# EAGLE design apprino (EAGLE 6.2)
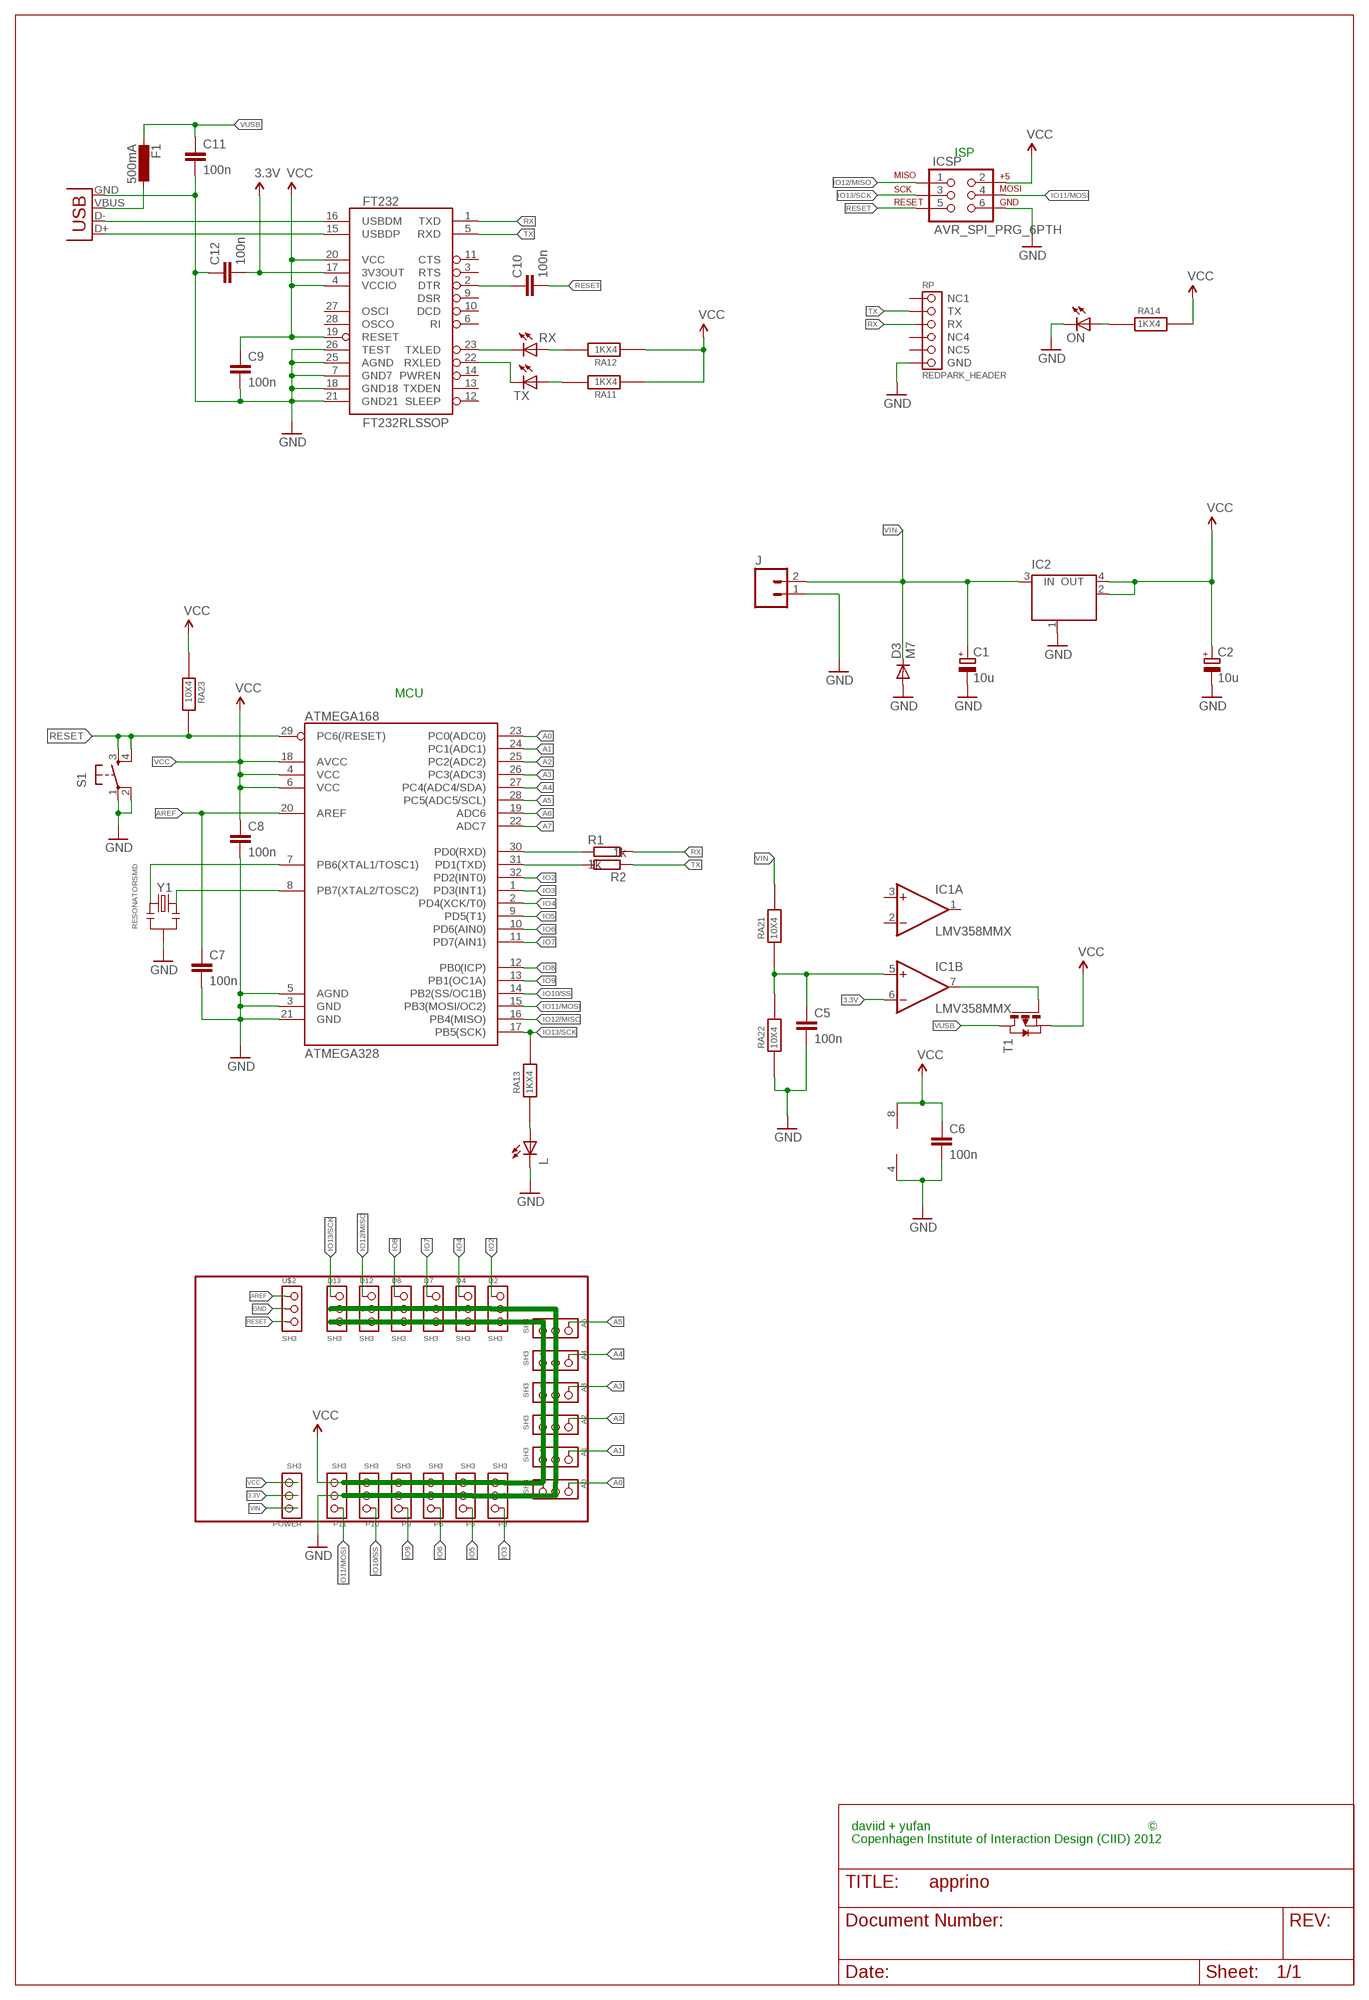
[diagram p0: schematic, sheet 1]

## Parts
A0  SH3  [SH3]
A1  SH3  [SH3]
A2  SH3  [SH3]
A3  SH3  [SH3]
A4  SH3  [SH3]
A5  SH3  [SH3]
ATMEGA328  ATMEGA168  [TQFP32-08]
C1  10u  CPOL-EUSMCB  [SMC_B]
C2  10u  CPOL-EUSMCB  [SMC_B]
C5  100n  C-EUC0805  [C0805]
C6  100n  C-EUC0805  [C0805]
C7  100n  C-EUC0805  [C0805]
C8  100n  C-EUC0805  [C0805]
C9  100n  C-EUC0805  [C0805]
C10  100n  C-EUC0805  [C0805]
C11  100n  C-EUC0805  [C0805]
C12  100n  C-EUC0805  [C0805]
D2  SH3  [SH3]
D3  M7  DIODE-SMB  [SMB]
D4  SH3  [SH3]
D7  SH3  [SH3]
D8  SH3  [SH3]
D12  SH3  [SH3]
D13  SH3  [SH3]
F1  500mA  L-EUL1812  [L1812]
FT232  FT232RLSSOP  [SSOP28DB]
IC1  LMV358MMX  [MSOP08]
IC2  MC33269ST-3.3T3  [SOT223]
ICSP  AVR_SPI_PRG_6PTH  [2X3]
J  M02-JST-2MM-SMT  [JST-2-SMD]
L  LEDCHIP-LED0805  [CHIP-LED0805]
ON  LEDCHIP-LED0805  [CHIP-LED0805]
P3  SH3  [SH3]
P5  SH3  [SH3]
P6  SH3  [SH3]
P9  SH3  [SH3]
P10  SH3  [SH3]
P11  SH3  [SH3]
POWER  SH3  [SH3]
R1  1k  R-EU_M0805  [M0805]
R2  1k  R-EU_M0805  [M0805]
RA1  1KX4  [R4ARRAY]
RA2  10X4  [R4ARRAY]
RP  REDPARK_HEADER  [REDPARK_HEADER]
RX  LEDCHIP-LED0805  [CHIP-LED0805]
S1  TAC_SWITCHSMD  [TACTILE_SWITCH_SMD]
T1  PMOSSOT23  [SOT-23]
TX  LEDCHIP-LED0805  [CHIP-LED0805]
U$2  SH3  [SH3]
USB  USB-MICROB  [USB-MICROB]
Y1  RESONATORSMD  [RESONATOR-SMD]

## Nets
3.3V: C12.2 FT232.17(3V3OUT) IC1.6(B:-IN) POWER.-
A0: A0.S ATMEGA328.23(PC0(ADC0))
A1: A1.S ATMEGA328.24(PC1(ADC1))
A2: A2.S ATMEGA328.25(PC2(ADC2))
A3: A3.S ATMEGA328.26(PC3(ADC3))
A4: A4.S ATMEGA328.27(PC4(ADC4/SDA))
A5: A5.S ATMEGA328.28(PC5(ADC5/SCL))
A6: ATMEGA328.19(ADC6)
A7: ATMEGA328.22(ADC7)
AREF: ATMEGA328.20(AREF) C7.1 U$2.S
GND: A0.- A1.- A2.- A3.- A4.- A5.- ATMEGA328.3(GND) ATMEGA328.5(AGND) ATMEGA328.21(GND) C1.- C2.- C5.2 C6.2 C7.2 C8.2 C9.2 C11.2 C12.1 D2.- D3.A D4.- D7.- D8.- D12.- D13.- FT232.7(GND7) FT232.18(GND18) FT232.21(GND21) FT232.25(AGND) FT232.26(TEST) IC1.4(P:V-) IC2.1(GND/ADJ) ICSP.6 J.1 L.C ON.C P3.- P5.- P6.- P9.- P10.- P11.- RA2.2 RP.6(GND) S1.1 S1.2 U$2.- USB.GND Y1.2
IO2: ATMEGA328.32(PD2(INT0)) D2.S
IO3: ATMEGA328.1(PD3(INT1)) P3.S
IO4: ATMEGA328.2(PD4(XCK/T0)) D4.S
IO5: ATMEGA328.9(PD5(T1)) P5.S
IO6: ATMEGA328.10(PD6(AIN0)) P6.S
IO7: ATMEGA328.11(PD7(AIN1)) D7.S
IO8: ATMEGA328.12(PB0(ICP)) D8.S
IO9: ATMEGA328.13(PB1(OC1A)) P9.S
IO10/SS: ATMEGA328.14(PB2(SS/OC1B)) P10.S
IO11/MOSI: ATMEGA328.15(PB3(MOSI/OC2)) ICSP.4 P11.S
IO12/MISO: ATMEGA328.16(PB4(MISO)) D12.S ICSP.1
IO13/SCK: ATMEGA328.17(PB5(SCK)) D13.S ICSP.3 RA1.6
N$1: ATMEGA328.7(PB6(XTAL1/TOSC1)) Y1.1
N$2: ATMEGA328.8(PB7(XTAL2/TOSC2)) Y1.3
N$3: FT232.16(USBDM) USB.D-
N$4: FT232.15(USBDP) USB.D+
N$5: RA1.7 RX.A
N$6: FT232.23(TXLED) RX.C
N$7: F1.1 USB.VBUS
N$8: RA1.8 TX.A
N$9: ON.A RA1.4
N$10: L.A RA1.3
N$11: ATMEGA328.30(PD0(RXD)) R1.1
N$12: ATMEGA328.31(PD1(TXD)) R2.2
N$13: C10.1 FT232.2(DTR)
N$16: FT232.22(RXLED) TX.C
N$17: C5.1 IC1.5(B:+IN) RA2.1 RA2.7
N$18: IC1.7(B:OUT) T1.3(G)
RESET: ATMEGA328.29(PC6(/RESET)) C10.2 ICSP.5 RA2.6 S1.3 S1.4 U$2.+
RX: FT232.1(TXD) R1.2 RP.3(RX)
TX: FT232.5(RXD) R2.1 RP.2(TX)
VCC: A0.+ A1.+ A2.+ A3.+ A4.+ A5.+ ATMEGA328.4(VCC) ATMEGA328.6(VCC) ATMEGA328.18(AVCC) C2.+ C6.1 C8.1 C9.1 D2.+ D4.+ D7.+ D8.+ D12.+ D13.+ FT232.4(VCCIO) FT232.19(RESET) FT232.20(VCC) IC1.8(P:V+) IC2.2(OUT) IC2.4(OUT) ICSP.2 P3.+ P5.+ P6.+ P9.+ P10.+ P11.+ POWER.+ RA1.1 RA1.2 RA1.5 RA2.3 T1.2(S)
VIN: C1.+ D3.C IC2.3(IN) J.2 POWER.S RA2.8
VUSB: C11.1 F1.2 T1.1(D)
Unconnected: FT232.3(RTS) FT232.6(RI) FT232.9(DSR) FT232.10(DCD) FT232.11(CTS) FT232.12(SLEEP) FT232.13(TXDEN) FT232.14(PWREN) FT232.27(OSCI) FT232.28(OSCO) IC1.1(A:OUT) IC1.2(A:-IN) IC1.3(A:+IN) RA2.4 RA2.5 RP.1(NC1) RP.4(NC4) RP.5(NC5)

## Notes on the sheet
- ISP
- MCU
- daviid + yufan | ©
- Copenhagen Institute of Interaction Design (CIID) 2012

## Library data of the parts
A0 A1-A5 D2 D4 D7 D8 D12 D13 P3 P5 P6 P9-P11 POWER U$2 = appessory:SH3
ATMEGA328 = SparkFun:ATMEGA168
C1 C2 = rcl:CPOL-EU: POLARIZED CAPACITOR, European symbol
C5-C12 = rcl:C-EU: CAPACITOR, European symbol
D3 = diode:DIODE-: DIODE
F1 = rcl:L-EU: INDUCTOR, European symbol
FT232 = SparkFun:FT232RL: USB UART FT232RL 4th Generation USB UART (USB <-> Serial) Controller. Spark Fun Electronics SKU : COM-00650
IC1 = linear:LMV358?*: Dual General Purpose, Low Voltage, Rail-to-Rail Output Operational Amplifiers Source: http://www.national.com/mpf/LM/LMV321.html http://www.national.com/dt/lmv_qual.pdf
IC2 = linear:MC33269ST*: Adjustable Output Low Dropout Voltage Regulator 800 mA Source: http://www.onsemi.com/pub/Collateral/MC33269-D.PDF
ICSP = SparkFun:AVR_SPI_PRG_6: AVR ISP 6 Pin This is the reduced ISP connector for AVR programming. Common on Arduino. This footprint will take up less PCB space and can be used with a 10-pin to 6-pin adapter such as SKU: BOB-08508
J = SparkFun:M02: Header 2 Standard 2-pin 0.1" header. Use with straight break away headers (SKU : PRT-00116), right angle break away headers (PRT-00553), swiss pins (PRT-00743), machine pins (PRT-00117), and female headers (PRT-00115). Molex polarized connector foot print use with SKU : PRT-08233 with associated crimp pins and housings.
L ON RX TX = led:LED: LED OSRAM: - CHIPLED LG R971, LG N971, LY N971, LG Q971, LY Q971, LO R971, LY R971 LH N974, LH R974 LS Q976, LO Q976, LY Q976 LO Q996 - Hyper CHIPLED LW Q18S LB Q993, LB Q99A, LB R99A - SideLED LS A670, LO A670, LY A670, LG A670, LP A670 LB A673, LV A673, LT A673, LW A673 LH A674 LY A675 LS A676, LA A676, LO A676, LY A676, LW A676 LS A679, LY A679, LG A679 - Hyper Micro SIDELED® LS Y876, LA Y876, LO Y876, LY Y876 LT Y87S - SmartLED LW L88C, LW L88S LB L89C, LB L89S, LG L890 LS L89K, LO L89K, LY L89K LS L896, LA L896, LO L896, LY L896 - TOPLED LS T670, LO T670, LY T670, LG T670, LP T670 LSG T670, LSP T670, LSY T670, LOP T670, LYG T670 LG T671, LOG T671, LSG T671 LB T673, LV T673, LT T673, LW T673 LH T674 LS T676, LA T676, LO T676, LY T676, LB T676, LH T676, LSB T676, LW T676 LB T67C, LV T67C, LT T67C, LS T67K, LO T67K, LY T67K, LW E67C LS E67B, LA E67B, LO E67B, LY E67B, LB E67C, LV E67C, LT E67C LW T67C LS T679, LY T679, LG T679 LS T770, LO T770, LY T770, LG T770, LP T770 LB T773, LV T773, LT T773, LW T773 LH T774 LS E675, LA E675, LY E675, LS T675 LS T776, LA T776, LO T776, LY T776, LB T776 LHGB T686 LT T68C, LB T68C - Hyper Mini TOPLED® LB M676 - Mini TOPLED Santana® LG M470 LS M47K, LO M47K, LY M47K Source: http://www.osram.convergy.de LUXEON: - LUMILED® LXK2-PW12-R00, LXK2-PW12-S00, LXK2-PW14-U00, LXK2-PW14-V00 LXK2-PM12-R00, LXK2-PM12-S00, LXK2-PM14-U00 LXK2-PE12-Q00, LXK2-PE12-R00, LXK2-PE12-S00, LXK2-PE14-T00, LXK2-PE14-U00 LXK2-PB12-K00, LXK2-PB12-L00, LXK2-PB12-M00, LXK2-PB14-N00, LXK2-PB14-P00, LXK2-PB14-Q00 LXK2-PR12-L00, LXK2-PR12-M00, LXK2-PR14-Q00, LXK2-PR14-R00 LXK2-PD12-Q00, LXK2-PD12-R00, LXK2-PD12-S00 LXK2-PH12-R00, LXK2-PH12-S00 LXK2-PL12-P00, LXK2-PL12-Q00, LXK2-PL12-R00 Source: www.luxeon.com KINGBRIGHT: KA-3528ASYC Source: www.kingbright.com
R1 R2 = rcl:R-EU_: RESISTOR, European symbol
RA1 = appessory:1KX4
RA2 = appessory:10X4
RP = appessory:REDPARK_HEADER
S1 = SparkFun:TAC_SWITCH: Momentary Switch Button commonly used for reset or general input. Spark Fun Electronics SKU : COM-00097
T1 = zetex:PMOSSOT23: MOS FET; OC_FARNELL: unknown; OC_NEWARK: unknown
USB = SparkFun:USB: USB Connectors USB-B-PTH is fully proven SKU : PRT-00139 USB-miniB is fully proven SKU : PRT-00587 USB-A-PCB is untested. USB-A-H is throughly reviewed, but untested. Spark Fun Electronics SKU : PRT-00437 USB-B-SMT is throughly reviewed, but untested. Needs silkscreen touching up. USB-A-S has not been used/tested USB-MB-H has not been used/tested
Y1 = SparkFun:RESONATOR: Resonator Small SMD resonator. This is the itty bitty 10/20MHz resonators with built in caps. CSTCE10M0G55 and CSTCE20M0V53. Footprint has been reviewed closely but hasn't been tested yet.

## Board
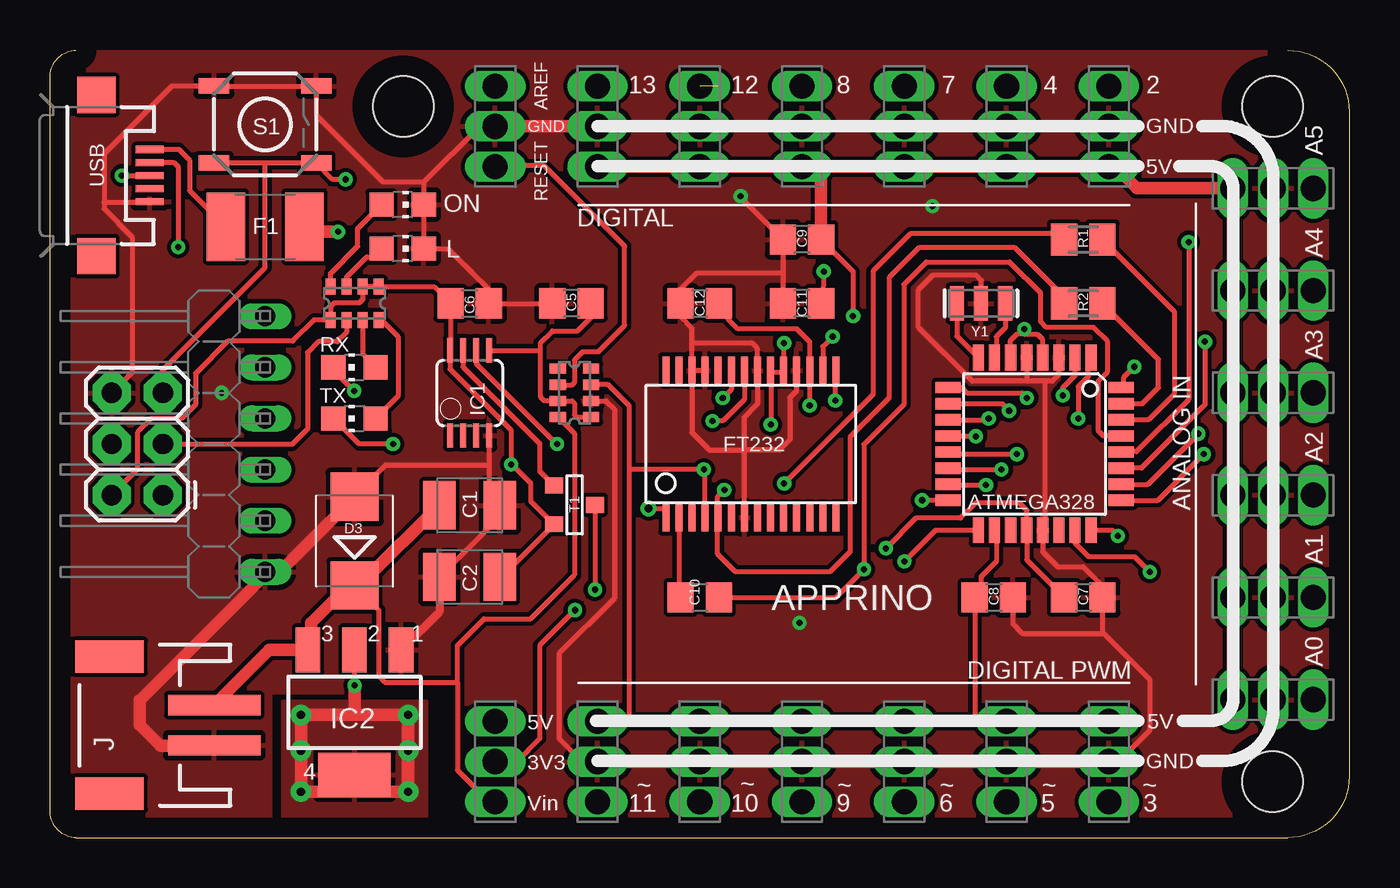
[diagram p1: board, top side]
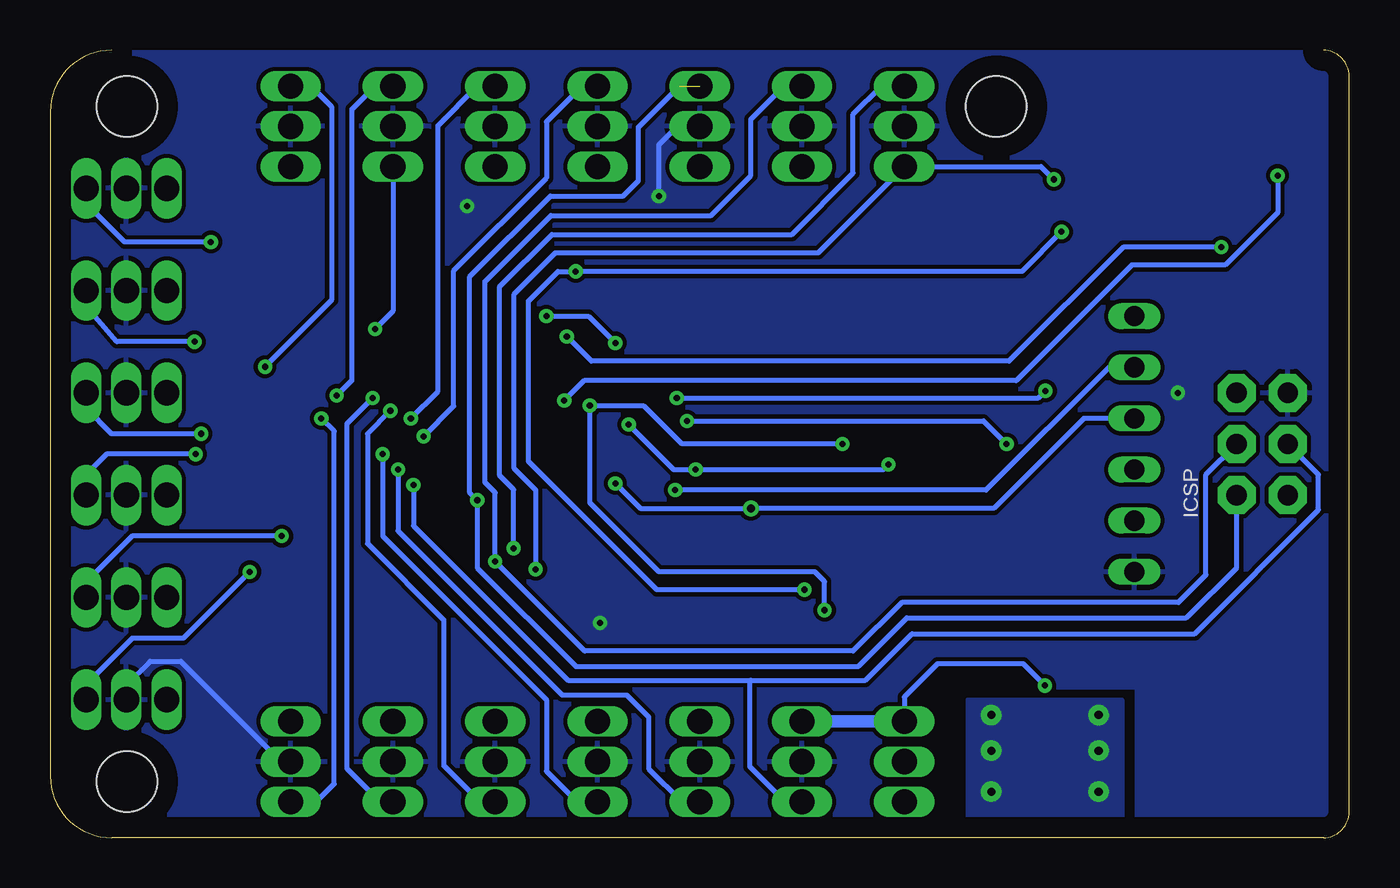
[diagram p2: board, bottom side, seen from below]

Size 64.52 x 39.12 mm. Coordinates in mm from the lower left corner, seen from the top.
Outline: 61.47,39.12 arc-90 64.52,36.07 64.52,3.05 arc-90 61.47,0 1.27,0 arc-90 0,1.27 0,37.85 arc-90 1.27,39.12
Copper layers (1*16): Top 0.035mm / dielectric 1.5mm / Bottom 0.035mm
Design rules: minimum track width 10mil, minimum drill 19mil, track to track 8mil, track to pad 8mil, pad to pad 8mil, via to via 8mil, smd to smd 8mil, copper to edge 40mil, drill to drill 8mil, minimum pad ring 5mil, minimum via ring 8mil, stop-mask expansion 4mil, vias tented up to drill 0mil, thermal gap 10mil
Holes 3 mm at 60.71,2.79 60.71,36.32 17.53,36.32

### Footprints (pad centres in the part's own frame; a part is rotated, then mirrored left to right if it is on the bottom)
SH3 = drill 1.25 pad 1.5 long: + 0,-4; - 0,-2; S 0,0
TQFP32-08 = smd 1.27 x 0.559: 1 -4.293,2.8; 2 -4.293,2; 3 -4.293,1.2; 4 -4.293,0.4; 5 -4.293,-0.4; 6 -4.293,-1.2; 7 -4.293,-2; 8 -4.293,-2.8; 17 4.293,-2.8; 18 4.293,-2; 19 4.293,-1.2; 20 4.293,-0.4; 21 4.293,0.4; 22 4.293,1.2; 23 4.293,2; 24 4.293,2.8 | smd 0.559 x 1.27: 9 -2.8,-4.293; 10 -2,-4.293; 11 -1.2,-4.293; 12 -0.4,-4.293; 13 0.4,-4.293; 14 1.2,-4.293; 15 2,-4.293; 16 2.8,-4.293; 25 2.8,4.293; 26 2,4.293; 27 1.2,4.293; 28 0.4,4.293; 29 -0.4,4.293; 30 -1.2,4.293; 31 -2,4.293; 32 -2.8,4.293
SMC_B = smd 1.6 x 2.4: + -1.5,0; - 1.5,0
C0805 = smd 1.3 x 1.5: 1 -0.95,0; 2 0.95,0
SMB = smd 2.4 x 2.4: A 2.2,0; C -2.2,0
L1812 = smd 1.9 x 3.4: 1 -1.95,0; 2 1.95,0
SSOP28DB = smd 0.348 x 1.397: 1 -4.225,-3.656; 2 -3.575,-3.656; 3 -2.925,-3.656; 4 -2.275,-3.656; 5 -1.625,-3.656; 6 -0.975,-3.656; 7 -0.325,-3.656; 8 0.325,-3.656; 9 0.975,-3.656; 10 1.625,-3.656; 11 2.275,-3.656; 12 2.925,-3.656; 13 3.575,-3.656; 14 4.225,-3.656; 15 4.225,3.656; 16 3.575,3.656; 17 2.925,3.656; 18 2.275,3.656; 19 1.625,3.656; 20 0.975,3.656; 21 0.325,3.656; 22 -0.325,3.656; 23 -0.975,3.656; 24 -1.625,3.656; 25 -2.275,3.656; 26 -2.925,3.656; 27 -3.575,3.656; 28 -4.225,3.656
MSOP08 = smd 0.3 x 1.2: 1 -0.976,-2.113; 2 -0.326,-2.113; 3 0.324,-2.113; 4 0.974,-2.113; 5 0.974,2.112; 6 0.324,2.112; 7 -0.326,2.112; 8 -0.976,2.112
SOT223 = smd 1.219 x 2.235: 1 -2.311,-3.099; 2 0,-3.099; 3 2.311,-3.099 | smd 3.6 x 2.2: 4 0,3.099
2X3 = drill 1.016 pad 1.88 octagon: 1 0,0; 2 0,2.54; 3 2.54,0; 4 2.54,2.54; 5 5.08,0; 6 5.08,2.54
JST-2-SMD = smd 1 x 4.6: 1 -1,-3.7; 2 1,-3.7 | smd 1.6 x 3.4: NC1 -3.4,1.5; NC2 3.4,1.5
CHIP-LED0805 = smd 1.2 x 1.2: A 0,-1.05; C 0,1.05
M0805 = smd 1.3 x 1.6: 1 -0.95,0; 2 0.95,0
R4ARRAY = smd 0.5 x 0.8: 1 -1.2,-0.826; 2 -0.4,-0.826; 3 0.4,-0.826; 4 1.2,-0.826; 5 1.2,0.826; 6 0.4,0.826; 7 -0.4,0.826; 8 -1.2,0.826
REDPARK_HEADER = drill 1 pad 1.3 long: 1 0,6.35; 2 0,3.81; 3 0,1.27; 4 0,-1.27; 5 0,-3.81; 6 0,-6.35
TACTILE_SWITCH_SMD = smd 1.524 x 0.762: 1 -2.54,1.905; 2 2.54,1.905; 3 -2.54,-1.905; 4 2.54,-1.905
SOT-23 = smd 0.787 x 0.889: 1 0.025,-1.016; 2 -0.94,1.016; 3 0.991,1.016
USB-MICROB = smd 0.35 x 1.4: D+ 0,2.65; D- -0.65,2.65; GND 1.3,2.65; ID 0.65,2.65; VBUS -1.3,2.65 | smd 1.8 x 1.9: MT1 -4,0; MT2 4,0
RESONATOR-SMD = smd 0.7 x 1.7: 1 -1.2,0; 2 0,0; 3 1.2,0

### Placement (x,y rotation side)
A0  62.74,6.86 270 top
A1  62.74,11.94 270 top
A2  62.74,17.02 270 top
A3  62.74,22.1 270 top
A4  62.74,27.18 270 top
A5  62.74,32.26 270 top
ATMEGA328  48.9,19.56 270 top
C1  20.83,16.51 0 top
C2  20.83,12.95 180 top
C5  25.88,26.54 180 top
C6  20.83,26.54 0 top
C7  51.31,11.94 0 top
C8  46.86,11.94 0 top
C9  37.34,29.72 180 top
C10  32.26,11.94 0 top
C11  37.34,26.54 180 top
C12  32.26,26.54 0 top
D2  52.58,37.34 0 top
D3  15.11,14.73 90 top
D4  47.5,37.34 0 top
D7  42.42,37.34 0 top
D8  37.34,37.34 0 top
D12  32.26,37.34 0 top
D13  27.18,37.34 0 top
F1  10.67,30.35 0 top
FT232  34.8,19.56 0 top
IC1  20.83,22.1 0 top
IC2  15.11,6.22 180 top
ICSP  5.59,17.02 90 top
J  4.45,5.59 90 top
L  17.5,29.26 270 top
ON  17.5,31.45 270 top
P3  52.58,1.78 180 top
P5  47.5,1.78 180 top
P6  42.42,1.78 180 top
P9  37.34,1.78 180 top
P10  32.26,1.78 180 top
P11  27.18,1.78 180 top
POWER  22.1,1.78 180 top
R1  51.31,29.72 180 top
R2  51.31,26.54 0 top
RA1  15.11,26.54 180 top
RA2  26.04,22.1 90 top
RP  10.67,19.56 0 top
RX  15.11,23.37 90 top
S1  10.67,35.43 0 top
T1  26.04,16.51 90 top
TX  15.11,20.83 90 top
U$2  22.1,37.34 0 top
USB  2.29,32.89 270 top
Y1  46.23,26.54 180 top

### Tracks (layer width: path | path; a pad name or v marks a point on that pad's centre or on a via)
3.3V  (via drill 0.3 pad 0.5)
  Top 0.254: 33.21,26.48 C12.2 33.21,26.23 34.16,25.27 37.08,25.27 37.72,24.64 FT232.17 v37.72,21.47 v37.72,21.46 | IC1.6 21.15,23.55 25.15,19.56 v25.17,19.56 | v26.06,11.3 24.31,9.55 24.31,4.93 23.16,3.78 POWER.-
  Bottom 0.254: v25.17,19.56 25.2,19.58 33.17,19.58 35.05,21.46 v37.72,21.46 37.72,16.64 34.29,13.21 26.54,13.21 26.06,12.73 v26.06,11.3
A0  (via drill 0.3 pad 0.5)
  Top 0.254: ATMEGA328.23 50.9,14.64 51.56,13.97 53.85,13.97 v54.61,13.21
  Bottom 0.254: A0.S 62.74,7.62 60.45,9.91 57.91,9.91 v54.61,13.21
A1  (via drill 0.3 pad 0.5)
  Top 0.254: v53.02,14.99 52.74,15.27 ATMEGA328.24
  Bottom 0.254: v53.02,14.99 60.45,14.99 62.74,12.7 A1.S
A2  (via drill 0.3 pad 0.5)
  Top 0.254: ATMEGA328.25 55.01,16.76 v57.3,19.05
  Bottom 0.254: v57.3,19.05 61.72,19.05 62.74,18.03 A2.S
A3  (via drill 0.3 pad 0.5)
  Top 0.254: ATMEGA328.26 54.52,17.56 v57.02,20.07
  Bottom 0.254: v57.02,20.07 61.47,20.07 62.74,21.34 A3.S
A4  (via drill 0.3 pad 0.5)
  Top 0.254: ATMEGA328.27 54.2,18.36 57.35,21.51 v57.35,24.64
  Bottom 0.254: v57.35,24.64 61.21,24.64 62.74,26.42 A4.S
A5  (via drill 0.3 pad 0.5)
  Top 0.254: v56.54,29.59 56.54,21.77 53.95,19.18 53.21,19.18 ATMEGA328.28
  Bottom 0.254: v56.54,29.59 60.83,29.59 62.74,31.5 A5.S
AREF  (via drill 0.3 pad 0.5)
  Top 0.254: C7.1 48.5,13.8 ATMEGA328.20 48.51,15.28 48.51,16.26 48.13,16.64 45.97,16.64 45.21,15.88 43,15.88 v41.5,14.38
  Bottom 0.254: U$2.S 23.24,37.34 24.64,35.94 24.64,33.02 27.69,29.97 39.6,29.97 42.19,27.38 42.19,17.98 41.5,17.3 v41.5,14.38
GND  (via drill 0.3 pad 0.5)
  Top 0.254: ATMEGA328.5 48.5,23.39 48.51,23.37 48.51,22.68 | FT232.25 32.51,23.2 31.88,23.2 FT232.26 | 36.39,28.07 C9.2 34.29,31.82 v34.29,31.88 | 36.39,28.07 C11.2 | FT232.26 31.87,20.13 32.75,19.25 34.44,19.25 34.47,19.23 | 36.39,28.07 32.13,28.07 31.31,27.24 C12.1 31.29,26.53 31.29,25.91 31.87,25.33 31.87,24.56 | P3.- 53.05,3.78 54.61,5.33 54.61,7.87 52.32,10.16 | C8.2 47.81,10.61 48.26,10.16 52.32,10.16 | 52.32,10.16 52.26,10.23 C7.2 52.32,12 52.32,12.45 51.31,13.46 50.04,13.46 49.3,14.2 ATMEGA328.21 49.43,15.4 49.43,22.68 | U$2.- 22.07,35.31 21.29,35.31 18.54,32.56 | ICSP.6 4.06,23.11 4.06,29.84 2.67,31.24 2.67,31.56 | 2.67,31.56 2.67,33.97 6.03,37.34 S1.1 S1.2 13.21,35.89 16.51,32.59 18.52,32.59 18.54,32.56 | USB.GND 4.9,31.56 2.67,31.56 | FT232.18 37.08,23.2 37.08,22.22 36.73,21.87 36.73,19.76 36.22,19.25 34.49,19.25 34.47,19.23 | C5.2 C6.2 21.74,26.58 21.74,27.28 19.76,29.26 L.C ON.C 18.54,32.56 | FT232.26 31.87,24.56 | 31.87,24.56 34.87,24.56 35.12,24.31 FT232.21 35.12,21.53 34.47,20.88 34.47,19.23 | RA2.2 27.6,21.7 28.02,21.29 28.02,11.89 25.27,9.14 25.27,4.9 26.4,3.78 P11.- | IC1.4 21.8,18.47 | 21.8,18.47 21.8,16.51 C1.- 22.33,15.95 C2.- | D3.A 15.11,16.97 16.66,18.52 21.75,18.52 21.8,18.47 | ATMEGA328.3 50.1,22.99 49.78,22.68 49.43,22.68 | 49.43,22.68 48.51,22.68 | 48.51,22.68 45.8,22.68 43.1,25.38 43.1,27.2 43.84,27.94 46,27.94 46.25,27.69 46.25,26.57 Y1.2 | 34.47,16.38 34.49,16.36 34.47,16.34 FT232.7 34.47,19.22 34.47,19.23
  Top 0.406: C2.- 19.33,11.23 IC2.1
  Top 0.61: P3.- P5.- P6.- P9.- P10.- P11.- | A5.- A4.- A3.- A2.- A1.- A0.- | U$2.- D13.- D12.- D8.- D7.- D4.- D2.- | J.1 7.88,4.57 5.49,4.57 4.45,5.61 4.45,6.83 10.67,13.06 RP.6 11.39,13.21 D3.A
  Bottom 0.254: v34.29,31.88 34.29,34.42 33.37,35.34 D12.- | A0.- 60.74,7.59 59.56,8.76 58.04,8.76 53.15,3.87 52.67,3.87 P3.-
  other vias: 37.21,10.67 43.82,31.37 8.51,22.1
  pour Bottom: 19.68,0.13 19.68,7.49 10.54,7.49 10.54,0.13 0.13,0.13 0.13,38.99 64.39,38.99 64.39,0.13
  pour Top: 10.92,0.13 10.92,7.24 19.3,7.24 19.3,0.13 64.39,0.13 64.39,38.99 0.13,38.99 0.13,0.13
IO2  (via drill 0.3 pad 0.5)
  Top 0.254: 53.33,22.36 ATMEGA328.32 | 53.33,22.36 53.34,22.35 | 53.33,22.36 53.33,22.88 v53.85,23.39
  Bottom 0.254: D2.S 51.56,37.34 50.55,36.32 50.55,26.7 v53.85,23.39
IO3  (via drill 0.3 pad 0.5)
  Top 0.254: v51.05,20.83 51.05,22.4 51.56,22.91 51.56,23.3 51.7,23.44 ATMEGA328.1
  Bottom 0.254: P3.S 51.31,1.78 50.42,2.67 50.42,20.19 v51.05,20.83
IO4  (via drill 0.3 pad 0.5)
  Top 0.254: ATMEGA328.2 50.9,22.95 50.29,22.35 v50.29,21.97
  Bottom 0.254: v50.29,21.97 49.53,22.73 49.53,36.2 48.39,37.34 D4.S
IO5  (via drill 0.3 pad 0.5)
  Top 0.254: ATMEGA328.9 45.26,22.35 45.52,22.1 48.26,22.1 v48.51,21.84
  Bottom 0.254: P5.S 48.13,1.78 49.78,3.43 49.78,20.57 v48.51,21.84
IO6  (via drill 0.3 pad 0.5)
  Top 0.254: ATMEGA328.10 47.28,21.56 v47.62,21.21
  Bottom 0.254: v47.62,21.21 48.77,20.07 48.77,14.61 44.96,10.8 44.96,3.56 43.18,1.78 P6.S
IO7  (via drill 0.3 pad 0.5)
  Top 0.254: ATMEGA328.11 46.54,20.76 v46.61,20.83
  Bottom 0.254: v46.61,20.83 45.26,22.17 45.26,35.38 43.28,37.36 42.44,37.36 D7.S
IO8  (via drill 0.3 pad 0.5)
  Top 0.254: ATMEGA328.12 45.83,19.96 v45.97,19.94
  Bottom 0.254: D8.S 38.1,37.34 39.88,35.56 39.88,32.77 44.48,28.17 44.48,21.44 v45.97,19.94
IO9  (via drill 0.3 pad 0.5)
  Top 0.254: ATMEGA328.13 44.7,19.06 44.7,19.05 v48.01,19.05
  Bottom 0.254: P9.S 38.35,1.78 39.88,3.3 39.88,6.86 48.01,14.99 v48.01,19.05
IO10/SS  (via drill 0.3 pad 0.5)
  Top 0.254: ATMEGA328.14 44.6,18.29 v47.24,18.29
  Bottom 0.254: P10.S 33.15,1.78 34.8,3.43 34.8,5.99 35.89,7.09 39.09,7.09 47.24,15.24 v47.24,18.29
IO11/MOSI  (via drill 0.3 pad 0.5)
  Top 0.254: ATMEGA328.15 44.57,17.53 v46.48,17.53
  Bottom 0.254: ICSP.4 1.52,18.03 1.52,16.28 7.67,10.14 21.72,10.14 24.03,7.82 29.72,7.82 | v46.48,17.53 46.48,15.49 38.81,7.82 29.72,7.82 | P11.S 28.02,1.78 29.77,3.53 29.77,7.77 29.72,7.82
IO12/MISO  (via drill 0.3 pad 0.5)  (1 unrouted)
  Top 0.254: ATMEGA328.16 43.82,16.76 v43.31,16.76
  Bottom 0.254: ICSP.1 5.59,13.41 8.08,10.92 21.97,10.92 24.38,8.51 38.41,8.51 43.31,13.41 v43.31,16.76 43.69,17.14 43.69,27.86 39.68,31.88 36.07,31.88 35.31,32.64 35.31,35.31 33.27,37.34
IO13/SCK  (via drill 0.3 pad 0.5)
  Top 0.254: ATMEGA328.17 46.1,15.12 46.23,14.99 | ATMEGA328.17 46.1,14.98 | ATMEGA328.17 | ATMEGA328.17 43.97,15.27 v42.42,13.72 | RA1.6 14.71,25.1 14.25,24.64 13.31,24.64 12.78,24.11 12.78,20.29 12.01,19.53 5.61,19.53 ICSP.3
  Bottom 0.254: D13.S 28.07,37.34 29.72,35.69 29.72,32.89 31.7,30.91 39.65,30.91 42.93,27.63 42.93,17.65 42.42,17.14 v42.42,13.72 37.97,9.27 24.64,9.27 22.22,11.68 8.48,11.68 7.11,13.06 7.11,18.03 ICSP.3
N$1
  Top 0.254: 46.92,23.88 ATMEGA328.7 46.99,23.95 46.99,24.89 47.43,25.33 Y1.1
N$2
  Top 0.254: Y1.3 45.03,24.92 ATMEGA328.8
N$3  (via drill 0.3 pad 0.5)
  Top 0.254: v38.86,24.89 38.37,24.4 FT232.16 | USB.D- 4.7,33.53 6.16,33.53 6.35,33.34 v6.35,29.34
  Bottom 0.254: v6.35,29.34 11.23,29.34 16.89,23.67 37.64,23.67 v38.86,24.89
N$4  (via drill 0.3 pad 0.5)
  Top 0.254: v38.99,21.72 38.99,23.18 FT232.15 | v3.56,32.89 USB.D+
  Bottom 0.254: v3.56,32.89 3.56,31.05 6.16,28.45 10.8,28.45 16.54,22.71 38,22.71 v38.99,21.72
N$5
  Top 0.254: RA1.7 15.51,24.02 RX.A
N$6  (via drill 0.3 pad 0.5)
  Top 0.254: FT232.23 33.82,22.27 v33.4,21.84 | RX.C 14.1,23.33 14.1,23.19 v15.09,22.2
  Bottom 0.254: 15.16,22.12 arc-90 v15.09,22.2 15.44,21.84 v33.4,21.84
N$7
  Top 0.254: USB.VBUS 6.38,34.19 6.92,33.66 6.92,32.15 F1.1
N$8
  Top 0.254: RA1.8 16.37,25.79 17.27,24.89 17.27,21.94 TX.A
N$9
  Top 0.254: RA1.4 13.91,28.04 15.27,29.39 15.27,30.26 ON.A
N$10
  Top 0.254: RA1.3 14.71,27.84 15.72,28.85 16.04,28.85 L.A
N$11
  Top 0.254: R1.1 55.83,26.15 55.83,22.05 54.54,20.76 ATMEGA328.30
N$12
  Top 0.254: ATMEGA328.31 54.25,21.56 55.04,22.35 55.04,23.76 R2.2
N$13
  Top 0.254: FT232.2 31.22,12.02 C10.1
N$16  (via drill 0.3 pad 0.5)
  Top 0.254: v17.02,19.56 15.33,19.56 TX.C | FT232.22 34.47,21.77 33.4,20.7 v32.89,20.7
  Bottom 0.254: v32.89,20.7 18.16,20.7 v17.02,19.56
N$17
  Top 0.254: 26.83,26.3 C5.1 26.85,26.53 26.85,25.83 26.19,25.17 24.94,25.17 24.33,24.56 24.33,24.18 | 24.33,24.18 24.33,21.92 24.54,21.72 25.19,21.72 RA2.7 25.93,21.7 26.04,21.59 26.04,21.01 26.14,20.9 RA2.1 | IC1.5 24.3,24.21 24.33,24.18
N$18
  Top 0.254: IC1.7 20.5,23.39 24.31,19.58 24.31,18.21 T1.3
RESET  (via drill 0.3 pad 0.5)
  Top 0.254: S1.3 10.67,33.53 | 10.67,33.53 S1.4 14.03,32.7 v14.67,32.7 | ICSP.5 5.59,23.24 10.67,28.32 10.67,33.53 | 33.53,11.94 C10.2 39.01,11.94 v40.41,13.34 40.41,19.53 42.39,21.51 42.39,27.48 43.51,28.6 47.65,28.6 49.2,27.05 49.2,25.63 49.48,25.35 51.82,25.35 52.53,24.64 52.53,23.16 52.07,22.71 52.07,20.19 52.3,19.96 ATMEGA328.29 | RA2.6 25.93,22.5 26.04,22.61 26.04,23.72 26.44,24.13 27.2,24.13 28.52,25.45 28.52,29.39 24.54,33.38 22.14,33.38 U$2.+
  Bottom 0.254: v14.67,32.7 15.3,33.34 U$2.+ 25.82,29.62 25.82,29.6 26.36,29.06 39.42,29.06 41.48,27 41.48,18.34 40.41,17.27 v40.41,13.34
RX  (via drill 0.3 pad 0.5, 0.4 pad 0.5)
  Top 0.254: v29.72,16.36 30.57,16.36 FT232.1 | R1.2 50.08,30 42.72,30 40.87,28.14 40.87,22.02 v36.45,17.6
  Bottom 0.254: RP.3 13.18,20.83 17.65,16.36 v29.72,16.36 35.2,16.36 v36.45,17.6
TX  (via drill 0.3 pad 0.5)
  Top 0.254: v33.48,17.27 33.15,16.94 33.15,15.93 FT232.5 33.15,15.88 33.15,14.1 34.04,13.21 38.73,13.21 39.73,14.2 39.73,19.91 41.66,21.84 41.66,27.81 43.16,29.31 47.9,29.31 50.36,26.86 R2.1
  Bottom 0.254: RP.2 11.94,23.37 18.03,17.27 v33.48,17.27
VCC  (via drill 0.3 pad 0.5, 0.4 pad 1.02)
  Top 0.254: 35.79,23.2 35.87,23.11 36.32,23.11 FT232.19 36.45,23.24 v36.45,24.57 | 45.02,5.84 44.96,5.78 | ATMEGA328.18 46.92,15.24 46.99,15.24 46.99,13.72 46.23,12.95 46.23,12.25 C8.1 45.91,5.97 45.72,5.78 | ATMEGA328.6 47.7,24.71 48.01,25.02 48.39,25.02 | 48.39,25.02 49.02,25.02 49.28,24.77 49.28,23.87 ATMEGA328.4 | 38.35,29.72 C9.1 39.88,28.13 v39.88,25.91 | v15.11,7.56 IC2.2 | v48.39,25.27 48.39,25.02 | FT232.4 32.51,15.91 32.51,18.24 v32.46,18.29 28.75,18.29 | ICSP.2 4.32,18.29 4.32,20.12 5.03,20.83 6.53,20.83 7.21,21.51 7.21,23.06 8.81,24.66 12.04,24.66 13.09,25.72 RA1.5 13.92,26.39 14.1,26.57 15.34,26.57 15.51,26.74 RA1.2 RA1.1 19.05,27.37 C6.1 19.88,24.24 IC1.8 19.85,23.28 22.88,20.24 v22.88,18.54 22.94,18.54 23.88,17.6 23.88,16.71 T1.2 22.4,12.95 C2.+ | 28.75,18.29 28.75,21.46 27.71,22.5 RA2.3 | 28.75,18.29 28.75,5.91 28.63,5.78 | FT232.20 35.79,23.2 | 35.79,23.2 v35.79,20.52
  Top 0.5: A4.+ 58.74,26.67 | P11.+ 28.63,5.78 P10.+ P9.+ P6.+ 44.96,5.78 45.72,5.78 P5.+ P3.+
  Top 0.61: D13.+ D12.+ D8.+ 38.48,33.34 | 38.48,33.34 D7.+ D4.+ D2.+ 52.9,33.34 53.98,32.26 A5.+ 58.74,26.67 A3.+ A2.+ A1.+ A0.+ | C9.1 38.29,33.15 38.48,33.34 | v17.78,2.29 v12.45,2.29 v12.45,4.32 v12.45,6.1 15.11,6.1 | v17.78,2.29 v17.78,4.32 v17.78,6.1 15.11,6.1 | 15.11,6.1 v15.11,7.56 | v17.78,2.29 15.95,2.29 IC2.4
  Bottom 0.254: v39.88,25.91 37.78,25.91 v36.45,24.57 | v22.88,18.54 23.14,18.29 v32.46,18.29 33.55,18.29 v35.79,20.52 | D4.+ 47.5,26.16 v48.39,25.27 | v15.11,7.56 16.19,8.64 20.45,8.64 22.1,6.99 POWER.+
  Bottom 0.61: P11.+ POWER.+
  pour Bottom: 11.3,6.86 11.3,0.51 18.92,0.51 18.92,6.86
  pour Top: 11.56,0.51 18.67,0.51 18.67,6.73 11.56,6.73
VIN
  Top 0.254: 15.64,12.83 15.64,11.96 16.31,11.3 16.31,8.03 16.61,7.72 20.22,7.72 | RA2.8 26.04,20.07 26.04,13.06 23.85,10.87 21.54,10.87 20.22,9.55 20.22,7.72 | 20.22,7.72 20.22,3.35 21.79,1.78 POWER.S
  Top 0.61: D3.C 15.11,12.83 | 15.11,12.83 12.95,10.67 12.95,9.47 IC2.3 10.88,9.32 J.2 | 15.11,12.83 15.64,12.83 C1.+
VUSB  (via drill 0.3 pad 0.5)
  Top 0.254: 38.35,26.42 C11.1 38.41,26.67 v38.42,28.13 | 13.46,30.35 F1.2 | T1.1 v27.05,12.32
  Top 0.61: v14.29,30.1 12.87,30.1 F1.2
  Bottom 0.254: v14.29,30.1 16.26,28.13 v38.42,28.13 39.31,28.13 40.77,26.67 40.77,18.69 34.39,12.32 v27.05,12.32

### Text on the board
tPlace: AREF | 13 | 12 | 8 | 7 | 4 | 2 | GND | A5 | GND | 5V | RESET | DIGITAL | A4 | A3 | A2 | ANALOG IN | A1 | APPRINO | A0 | DIGITAL PWM | 5V | 5V | 3V3 | ~ | ~ | ~ | ~ | ~ | GND | ~ | 11 | 10 | 9 | 6 | 5 | 3 | Vin